# Altium project 平衡小车.PrjPCB
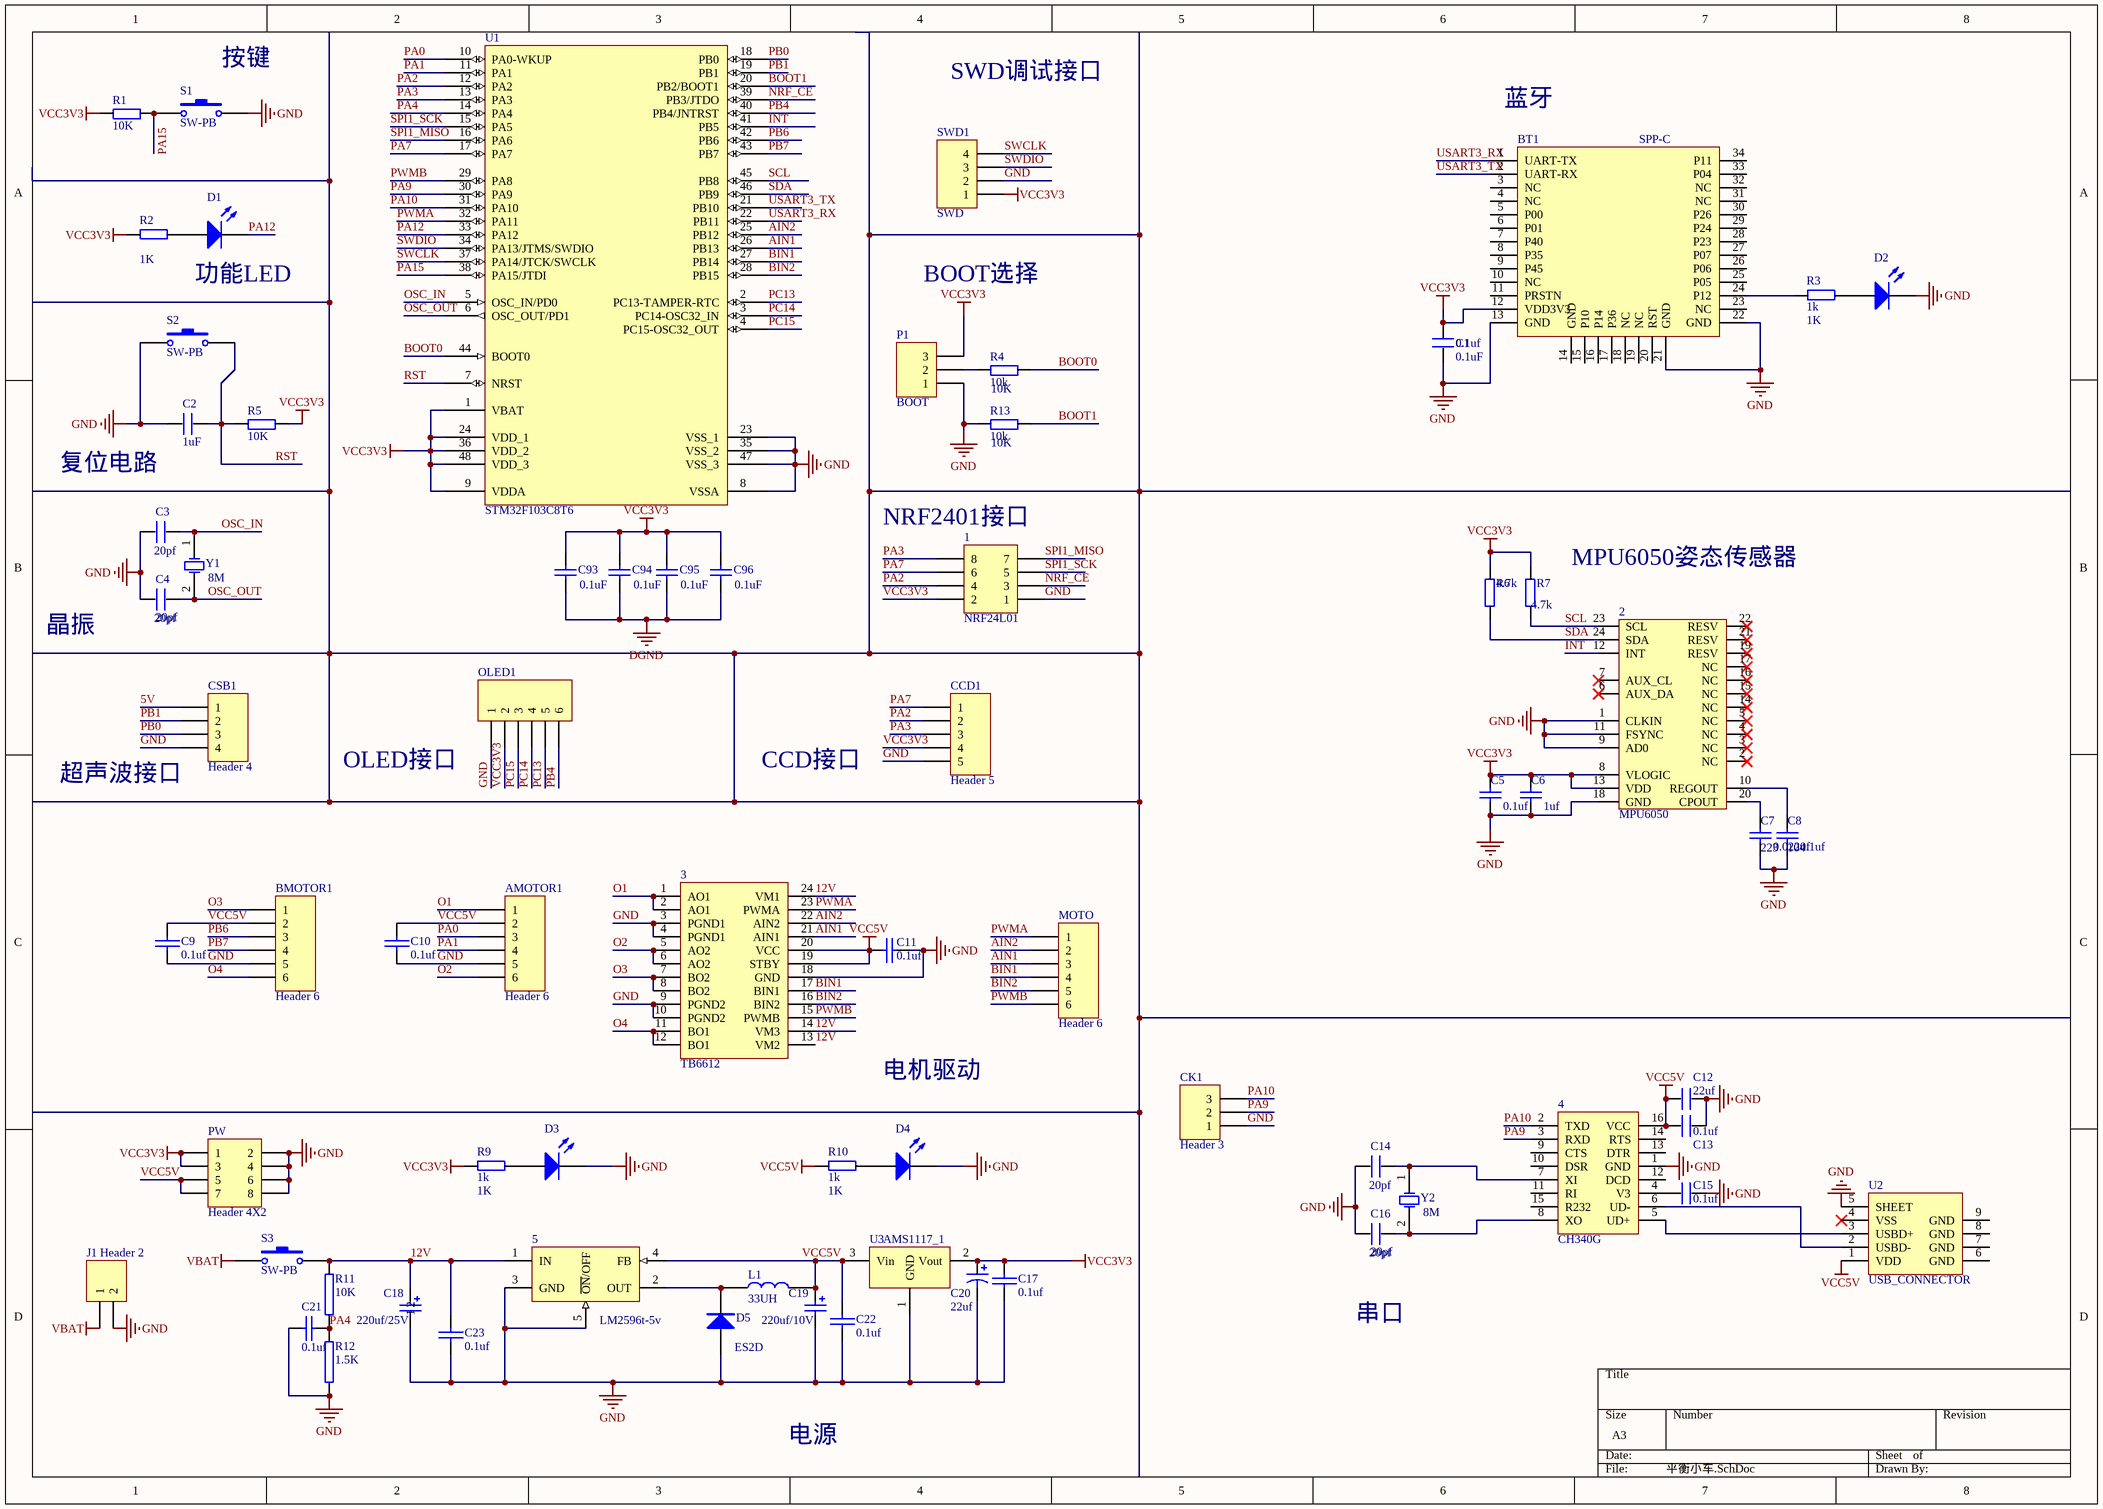
[diagram p0: 平衡小车.SchDoc]
1 sheet, 70 parts. Net scope: global (net labels, ports and power ports of the same name join across sheets).
Board files: Balance.PcbDoc, V2.PcbDoc

## Sheet 平衡小车.SchDoc
size A3

### Parts
1  NRF24L01  [LC-HDR2X4H]
2  MPU6050  [LC-QFN-24_4x4x05P]
3  TB6612  [TB6612]
4  CH340G  [SO-16]
5  LM2596t-5v  [LC-TO-263-5]
AMOTOR1  Header 6  [HDR1X6]
BMOTOR1  Header 6  [HDR1X6]
BT1  SPP-C  [SPP-C]
C1  0.1uf  [LC-0603_C]
C2  1uF  [LC-0603_C]
C3  20pf  [LC-0603_C]
C4  20pf  [LC-0603_C]
C5  0.1uf  [LC-0603_C]
C6  1uf  [LC-0603_C]
C7  0.022uf  value 223  [LC-0603_C]
C8  0.1uf  value 104  [LC-0603_C]
C9  0.1uf  [LC-0603_C]
C10  0.1uf  [LC-0603_C]
C11  0.1uf  [LC-0603_C]
C12  22uf  [LC-0805_C]
C13  0.1uf  [LC-0603_C]
C14  20pf  [LC-0603_C]
C15  0.1uf  [LC-0603_C]
C16  20pf  [LC-0603_C]
C17  0.1uf  [LC-0603_C]
C18  value 220uf/25V  [100UF钽电容]  (hidden comment: 100Uf)
C19  value 220uf/10V  [LC-1206_C]  (hidden comment: 100uf)
C20  22uf  [LC-0805_R]
C21  0.1uf  [LC-0603_C]
C22  0.1uf  [LC-0603_C]
C23  0.1uf  [LC-0603_C]
C93  0.1uf  [LC-0603_C]
C94  0.1uf  [LC-0603_C]
C95  0.1uf  [LC-0603_C]
C96  0.1uf  [LC-0603_C]
CCD1  Header 5  [HDR1X5]
CK1  Header 3  [HDR1X3]
CSB1  Header 4  [HDR1X4]
D1  LED0  [LC-0805_LED_S1]  (value not drawn)
D2  LED0  [LC-0805_LED_S1]  (value not drawn)
D3  LED0  [LC-0805_LED_S1]  (value not drawn)
D4  LED0  [LC-0805_LED_S1]  (value not drawn)
D5  ES2D  [LC-DO-213AB]
J1  Header 2  [VBAT]
L1  33UH  [330电感]
MOTO  Header 6  [HDR1X6]
OLED1  Header 6  [HDR1X6]  (value not drawn)
P1  BOOT  [HDR1X3]
PW  Header 4X2  [HDR2X4]
R1  10K  [LC-0603_R]
R2  value 1K  [LC-0603_R]
R3  1k  [LC-0603_R]
R4  10k  [LC-0603_R]
R5  10K  [LC-0603_R]
R6  4.7k  [LC-0603_R]
R7  4.7k  [LC-0603_R]
R9  1k  [LC-0603_R]
R10  1k  [LC-0603_R]
R11  10K  [LC-0603_R]
R12  1.5K  [LC-0603_R]
R13  10k  [LC-0603_R]
S1  SW-PB  [KEY]
S2  SW-PB  [KEY]
S3  SW-PB  [钮子开关]
SWD1  SWD  [HDR1X4]
U1  STM32F103C8T6  [LC-LQFP-48_7x7x05P]
U2  USB_CONNECTOR  [MINI_USB_FEMALE]
U3  AMS1117_1  [LC-SOT-223]
Y1  (no value)  [LC-HC-49S]
Y2  (no value)  [LC-HC-49S]

### Nets
DGND: C93.1 C94.1 C95.1 C96.1
GND: 1.1 2.1(CLKIN) 2.9(AD0) 2.11(FSYNC) 2.18(GND) 3.3(PGND1) 3.4(PGND1) 3.9(PGND2) 3.10(PGND2) 3.18(GND) 4.1(GND) 5.3(GND) 5.5(~{ON}/OFF) AMOTOR1.5 BMOTOR1.5 BT1.13(GND) BT1.21(GND) BT1.22(GND) C1.1 C2.1 C3.1 C4.1 C5.1 C6.1 C7.1 C8.1 C9.2 C10.2 C11.1 C12.1 C13.2 C14.1 C15.2 C16.1 C17.1 C18.2 C19.2 C20.2 C21.1 C22.1 C23.1 CCD1.5 CK1.1 CSB1.4 D2.2(K) D3.2(K) D4.2(K) D5.1 J1.2 OLED1.1 P1.1 PW.2 PW.4 PW.6 PW.8 R12.1 R13.1 S1.2 S2.1 SWD1.2 U1.8(VSSA) U1.23(VSS_1) U1.35(VSS_2) U1.47(VSS_3) U2.5(SHEET) U3.1(GND)
VBAT: J1.1 S3.1
VCC3V3: 1.2 2.8(VLOGIC) 2.13(VDD) BT1.12(VDD3V3) C1.2 C5.2 C6.2 C17.2 C20.1 C93.2 C94.2 C95.2 C96.2 CCD1.4 OLED1.2 P1.3 PW.1 PW.3 R1.1 R2.2 R5.2 R6.1 R7.1 R9.2 SWD1.1 U1.1(VBAT) U1.9(VDDA) U1.24(VDD_1) U1.36(VDD_2) U1.48(VDD_3) U3.2(Vout)
VCC5V: 3.19(STBY) 3.20(VCC) 4.16(VCC) 5.4(FB) AMOTOR1.2 BMOTOR1.2 C9.1 C10.1 C11.2 C12.2 C13.1 C19.1 C22.2 L1.2 PW.5 PW.7 R10.2 U2.1(VDD) U3.3(Vin)
5V: CSB1.1
12V: 3.13(VM2) 3.14(VM3) 3.24(VM1) 5.1(IN) C18.1 C23.2 R11.2 S3.2
AIN1: 3.21(AIN1) MOTO.3 U1.26(PB13)
AIN2: 3.22(AIN2) MOTO.2 U1.25(PB12)
BIN1: 3.17(BIN1) MOTO.4 U1.27(PB14)
BIN2: 3.16(BIN2) MOTO.5 U1.28(PB15)
BOOT0: R4.2 U1.44(BOOT0)
BOOT1: R13.2 U1.20(PB2/BOOT1)
INT: 2.12(INT) U1.41(PB5)
NRF_CE: 1.3 U1.39(PB3/JTDO)
O1: 3.1(AO1) 3.2(AO1) AMOTOR1.1
O2: 3.5(AO2) 3.6(AO2) AMOTOR1.6
O3: 3.7(BO2) 3.8(BO2) BMOTOR1.1
O4: 3.11(BO1) 3.12(BO1) BMOTOR1.6
OSC_IN: C3.2 U1.5(OSC_IN/PD0) Y1.1(OSC1)
OSC_OUT: C4.2 U1.6(OSC_OUT/PD1) Y1.2(OSC2)
PA0: AMOTOR1.3 U1.10(PA0-WKUP)
PA1: AMOTOR1.4 U1.11(PA1)
PA2: 1.4 CCD1.2 U1.12(PA2)
PA3: 1.8 CCD1.3 U1.13(PA3)
PA4: C21.2 R11.1 R12.2 U1.14(PA4)
PA7: 1.6 CCD1.1 U1.17(PA7)
PA9: 4.3(RXD) CK1.2 U1.30(PA9)
PA10: 4.2(TXD) CK1.3 U1.31(PA10)
PA12: D1.2(K) U1.33(PA12)
PA15: R1.2 S1.1 U1.38(PA15/JTDI)
PB0: CSB1.3 U1.18(PB0)
PB1: CSB1.2 U1.19(PB1)
PB4: OLED1.6 U1.40(PB4/JNTRST)
PB6: BMOTOR1.3 U1.42(PB6)
PB7: BMOTOR1.4 U1.43(PB7)
PC13: OLED1.5 U1.2(PC13-TAMPER-RTC)
PC14: OLED1.4 U1.3(PC14-OSC32_IN)
PC15: OLED1.3 U1.4(PC15-OSC32_OUT)
PWMA: 3.23(PWMA) MOTO.1 U1.32(PA11)
PWMB: 3.15(PWMB) MOTO.6 U1.29(PA8)
RST: C2.2 R5.1 S2.2 U1.7(NRST)
SCL: 2.23(SCL) R7.2 U1.45(PB8)
SDA: 2.24(SDA) R6.2 U1.46(PB9)
SPI1_MISO: 1.7 U1.16(PA6)
SPI1_SCK: 1.5 U1.15(PA5)
SWCLK: SWD1.4 U1.37(PA14/JTCK/SWCLK)
SWDIO: SWD1.3 U1.34(PA13/JTMS/SWDIO)
USART3_RX: BT1.1(UART-TX) U1.22(PB11)
USART3_TX: BT1.2(UART-RX) U1.21(PB10)
Net2_10: 2.10(REGOUT) C8.2
Net2_20: 2.20(CPOUT) C7.2
Net4_4: 4.4(V3) C15.1
Net4_5: 4.5(UD+) U2.3(USBD+)
Net4_6: 4.6(UD-) U2.2(USBD-)
Net4_7: 4.7(XI) C14.2 Y2.1(OSC1)
Net4_8: 4.8(XO) C16.2 Y2.2(OSC2)
Net5_2: 5.2(OUT) D5.2 L1.1
NetBT1_24: BT1.24(P12) R3.2
NetD1_1: D1.1(A) R2.1
NetD2_1: D2.1(A) R3.1
NetD3_1: D3.1(A) R9.1
NetD4_1: D4.1(A) R10.1
NetP1_2: P1.2 R4.1

Not connected (* = marked no-connect by the designer): 2 2(NC)* 3(NC)* 4(NC)* 5(NC)* 6(AUX_DA)* 7(AUX_CL)* 14(NC)* 15(NC)* 16(NC)* 17(NC)* 19(RESV)* 21(RESV)* 22(RESV)*; 4 9(CTS) 10(DSR) 11(RI) 12(DCD) 13(DTR) 14(RTS) 15(R232); BT1 3(NC) 4(NC) 5(P00) 6(P01) 7(P40) 8(P35) 9(P45) 10(NC) 11(PRSTN) 14(GND) 15(P10) 16(P14) 17(P36) 18(NC) 19(NC) 20(RST) 23(NC) 25(P05) 26(P06) 27(P07) 28(P23) 29(P24) 30(P26) 31(NC) 32(NC) 33(P04) 34(P11); U2 4(VSS)* 6(GND) 7(GND) 8(GND) 9(GND)

### Notes on the sheet
- (near S1) 按键
- SWD调试接口
- (near BT1) 蓝牙
- 功能LED
- BOOT选择
- 复位电路
- (near 1) NRF2401接口
- MPU6050姿态传感器
- 晶振
- 超声波接口
- OLED接口
- CCD接口
- 电机驱动
- 串口
- 电源
- (in symbol XTAL) 8M

### Library data of the parts
1 = Header 4X2H: Header, 4-Pin, Dual row, Right Angle; LatestRevisionDate: 17-Jul-2002; LatestRevisionNote: Re-released for DXP Platform.; Publisher: Altium Limited
2 = MPU6050: 9轴运动处理传感器
5 = LM2576: Simple Switcher 3A Step Down Voltage Regulator; Note: Tab is connected to GND; Published: 15-Apr-2002; Datasheet: Latest Revision: Jun-1999; Package Reference: TS5B; Publisher: Altium Limited
AMOTOR1 BMOTOR1 MOTO OLED1 = Header 6: Header, 6-Pin; LatestRevisionDate: 17-Jul-2002; LatestRevisionNote: Re-released for DXP Platform.; Publisher: Altium Limited
BT1 = SPP-C: sppc
C1 C3 C4 C12-C16 = C
  C1: value: 0.1uF
  C3 C4 C14 C16: value: 20pf
  C12: value: 22uf
  C13 C15: value: 0.1uf
C2 = C_1: value: 104
C5-C8 C93-C96 = Cap: Capacitor; Published: 8-Jun-2000; LatestRevisionDate: 17-Jul-2002; LatestRevisionNote: Re-released for DXP Platform.; PackageReference: RAD-0.3; Publisher: Altium Limited
  C5: PackageDescription: Radial Cap, Thru-Hole; 2 Leads; 0.3 in Pin Spacing; Value: 0.1uF
  C6: PackageDescription: Radial Cap, Thru-Hole; 2 Leads; 0.3 in Pin Spacing; Value: 1uF
  C7 C8: PackageDescription: Radial Cap, Thru-Hole; 2 Leads; 0.3 in Pin Spacing
  C93-C96: Value: 0.1uF
C9-C11 C17 C21-C23 = cap
C18 C19 = Cap Pol1: Polarized Capacitor (Radial); Published: 8-Jun-2000; LatestRevisionDate: 17-Jul-2002; LatestRevisionNote: Re-released for DXP Platform.; PackageReference: RB7.6-15; Publisher: Altium Limited; PackageDescription: Polarized Capacitor (Radial); 2 Leads
C20 = Cap Pol2: Polarized Capacitor (Axial); Published: 8-Jun-2000; LatestRevisionDate: 17-Jul-2002; LatestRevisionNote: Re-released for DXP Platform.; PackageReference: POLAR0.8; Publisher: Altium Limited; PackageDescription: Polarized Capacitor; 2 Leads
CCD1 = Header 5: Header, 5-Pin; LatestRevisionDate: 17-Jul-2002; LatestRevisionNote: Re-released for DXP Platform.; Publisher: Altium Limited
CK1 P1 = Header 3: Header, 3-Pin; LatestRevisionDate: 17-Jul-2002; LatestRevisionNote: Re-released for DXP Platform.; Publisher: Altium Limited
CSB1 SWD1 = Header 4: Header, 4-Pin; LatestRevisionDate: 17-Jul-2002; LatestRevisionNote: Re-released for DXP Platform.; Publisher: Altium Limited
D1-D4 = LED0: Typical INFRARED GaAs LED; Published: 8-Jun-2000; LatestRevisionDate: 08-Jul-2005; LatestRevisionNote: Mech Layer 1 removed.; PackageReference: LED-0; Publisher: Altium Limited
D5 = DIODE
J1 = Header 2: Header, 2-Pin; LatestRevisionDate: 17-Jul-2002; LatestRevisionNote: Re-released for DXP Platform.; Publisher: Altium Limited
L1 = Inductor
PW = Header 4X2: Header, 4-Pin, Dual row; LatestRevisionDate: 17-Jul-2002; LatestRevisionNote: Re-released for DXP Platform.; Publisher: Altium Limited
R1-R3 R5-R7 R9 R10 = R_1
  R1 R5: value: 10K
  R3 R9 R10: value: 1K
  R6 R7: value: 4.7K
R4 R13 = R: value: 10K
R11 R12 = res
S1-S3 = SW-PB: Switch; Published: 24-Mar-1999; LatestRevisionDate: 17-Jul-2002; LatestRevisionNote: Re-released for DXP Platform.; PackageReference: SPST-2; Publisher: Altium Limited; PackageDescription: Switch; 2 Leads
U1 = STM32F103C8T6: STM32 ARM-based 32-bit MCU with 64 Kbytes Flash, 48-pin LQFP, Industrial Temperature; Published: 30-May-2008; DatasheetVersion: rev6, Mar-2008; PackageVersion: Mar-2008; PackageReference: LQFP48; Publisher: Altium Limited; PackageDescription: 48-Pin Low-Profile Quad Flat Pack, 7 x 7 mm Body, 0.5 mm Pitch (LQFP48); ComponentLink1Description: Manufacturer Link; ComponentLink1URL: www.st.com/stm32; ComponentLink2Description: Datasheet; ComponentLink2URL: http://www.st.com/stonline/products/literature/ds/13587.pdf
U3 = AMS1117_1: 3.3V电压转换器AMS1117
Y1 Y2 = XTAL: Crystal Oscillator; Published: 8-Jun-2000; LatestRevisionDate: 17-Jul-2002; LatestRevisionNote: Re-released for DXP Platform.; Publisher: Altium Limited